# Altium schematic sheet Sheet1.SchDoc
size A4; Author: Caven; Revision: V2.0; SheetNumber: 1; SheetTotal: 2
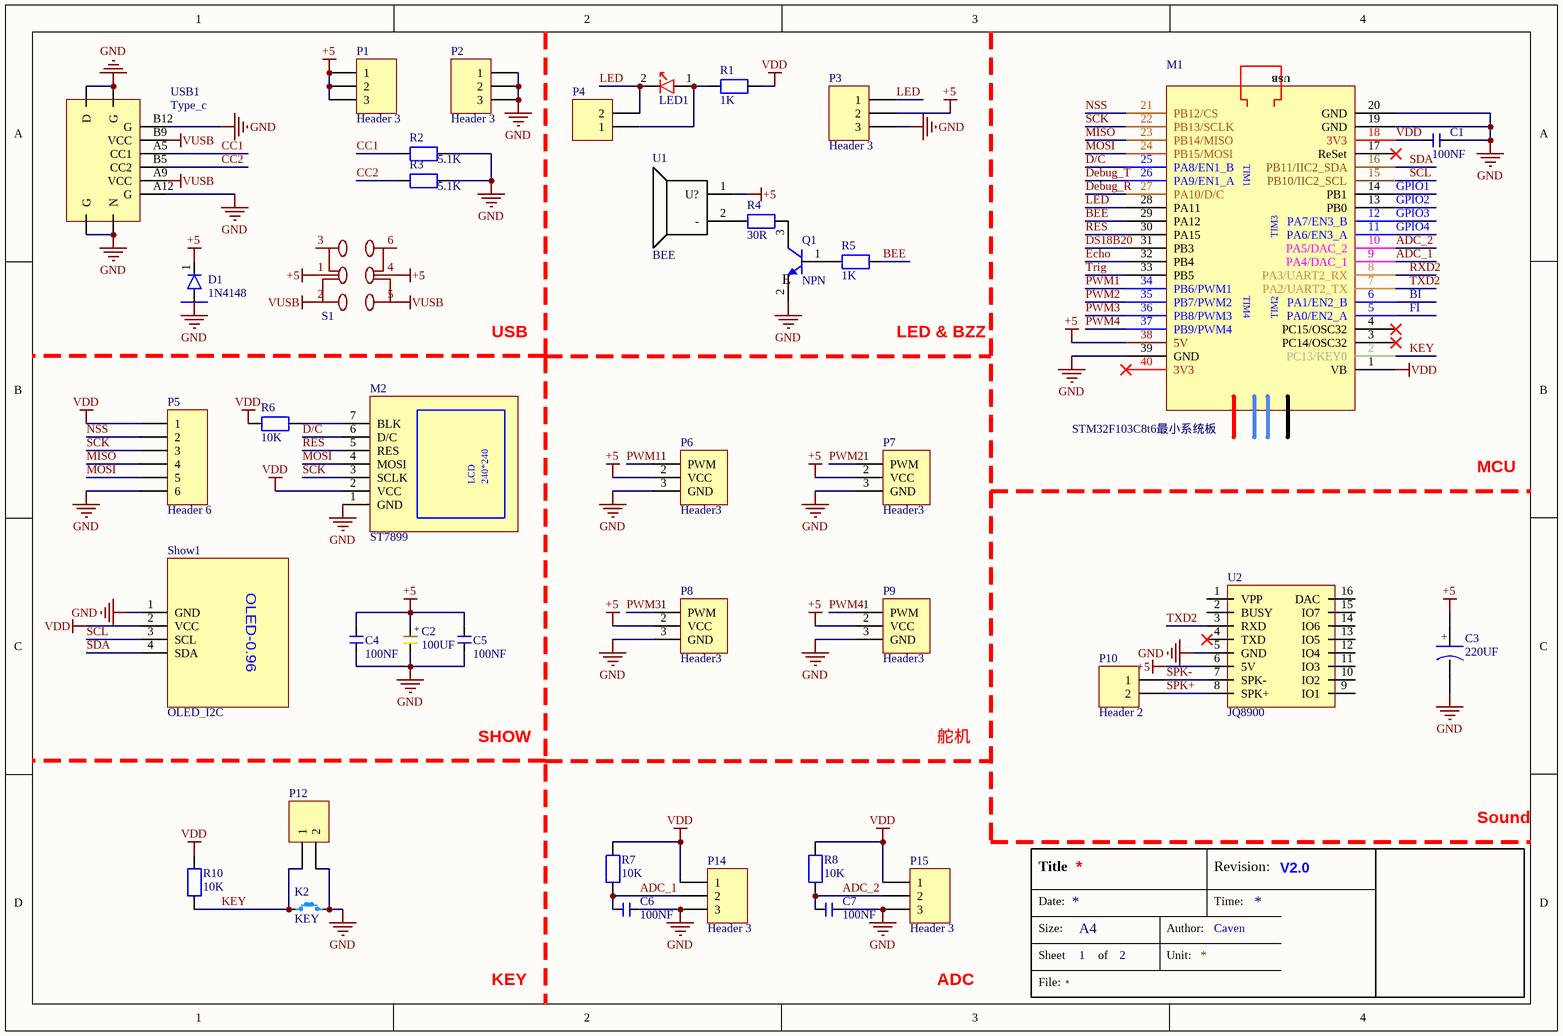
[diagram p0: Sheet1.SchDoc]

## Parts
C1  100NF  [CAP_0603]
C2  100UF  [CAP_3216_A]
C3  220UF  [CAP_PR_2.5_6.3_RA]
C4  100NF  [CAP_0603]
C5  100NF  [CAP_0603]
C6  100NF  [CAP_0603]
C7  100NF  [CAP_0603]
D1  1N4148  [Diode_DO35]
K2  KEY  [SW_PB_3X6]
LED1  LED_R/G/B/Y  [LED_5MM]  (value not drawn)
M1  STM32F103C8t6最小系统板  [STM32F103C8_Simple]
M2  ST7899  [LCD_1.3_MODE]
P1  Header 3  [Header 2.54X3]
P2  Header 3  [Header 2.54X3]
P3  Header 3  [XH_2.54_3P]
P4  Header 2  [XH_2.54_2P]  (value not drawn)
P5  Header 6  [HDR1X6]
P6  Header3  [Header 2.54X3]
P7  Header3  [Header 2.54X3]
P8  Header3  [Header 2.54X3]
P9  Header3  [Header 2.54X3]
P10  Header 2  [XH2.54-WI-2P]
P12  Header 2  [XH_2.54_2P]  (value not drawn)
P14  Header 3  [HDR1X3]
P15  Header 3  [HDR1X3]
Q1  NPN  [SOT23_3]
R1  1K  [RES_0.4_1/4W]
R2  5.1K  [RESC_0603_2]
R3  5.1K  [RESC_0603_2]
R4  30R  [RES_0.4_1/4W]
R5  1K  [RES_0.4_1/4W]
R6  10K  [RES_0.4_1/4W]
R7  10K  [RES_0.4_1/4W]
R8  10K  [RES_0.4_1/4W]
R10  10K  [RES_0.4_1/4W]
S1  Switch.02  [SWITCH-KFC-7]  (value not drawn)
Show1  OLED_I2C  [Header F 2.54X4]
U1  BEE  [BEE-FMQ5mm]
U2  JQ8900  [SpkMo]
USB1  Type_c  [USB-Type-c_6P]

## Nets
+5: C2.1 C3.1 C4.2 C5.2 D1.1(N) M1.38(5V) P1.1 P1.2 P1.3 P3.2 P6.2(VCC) P7.2(VCC) P8.2(VCC) P9.2(VCC) S1.1 S1.4 U1.1(U?) U2.6(5V)
GND: C1.1 C2.2 C3.2 C4.1 C5.1 C6.2 C7.2 D1.2(P) K2.1 M1.19(GND) M1.20(GND) M1.39(GND) M2.1(GND) P2.1 P2.2 P2.3 P3.3 P5.6 P6.3(GND) P7.3(GND) P8.3(GND) P9.3(GND) P12.2 P14.3 P15.3 Q1.2(E) R2.2 R3.2 Show1.1(GND) U2.5(GND) USB1.A(G) USB1.A12(G) USB1.B(N) USB1.B12(G) USB1.C(D) USB1.D(G)
VDD: C1.2 M1.1(VB) M1.18(3V3) M2.2(VCC) P5.1 P14.1 P15.1 R1.1 R6.2 R7.2 R8.2 R10.2 Show1.2(VCC)
VUSB: S1.2 S1.5 USB1.A9(VCC) USB1.B9(VCC)
ADC_1: C6.1 M1.9(PA4/DAC_1) P14.2 R7.1
ADC_2: C7.1 M1.10(PA5/DAC_2) P15.2 R8.1
BEE: M1.29(PA12) R5.1
BI: M1.6(PA1/EN2_B)
CC1: R2.1 USB1.A5(CC1)
CC2: R3.1 USB1.B5(CC2)
D/C: M1.25(PA8/EN1_B) M2.6(D/C)
Debug_R: M1.27(PA10/D/C)
Debug_T: M1.26(PA9/EN1_A)
DS18B20: M1.31(PB3)
Echo: M1.32(PB4)
FI: M1.5(PA0/EN2_A)
GPIO1: M1.14(PB1)
GPIO2: M1.13(PB0)
GPIO3: M1.12(PA7/EN3_B)
GPIO4: M1.11(PA6/EN3_A)
KEY: K2.2 M1.2(PC13/KEY0) P12.1 R10.1
LED: LED1.2(-) M1.28(PA11) P3.1 P4.2
MISO: M1.23(PB14/MISO) P5.4
MOSI: M1.24(PB15/MOSI) M2.4(MOSI) P5.5
NSS: M1.21(PB12/CS) P5.2
PWM1: M1.34(PB6/PWM1) P6.1(PWM)
PWM2: M1.35(PB7/PWM2) P7.1(PWM)
PWM3: M1.36(PB8/PWM3) P8.1(PWM)
PWM4: M1.37(PB9/PWM4) P9.1(PWM)
RES: M1.30(PA15) M2.5(RES)
RXD2: M1.8(PA3/UART2_RX)
SCK: M1.22(PB13/SCLK) M2.3(SCLK) P5.3
SCL: M1.15(PB10/IIC2_SCL) Show1.3(SCL)
SDA: M1.16(PB11/IIC2_SDA) Show1.4(SDA)
SPK+: P10.2 U2.8(SPK+)
SPK-: P10.1 U2.7(SPK-)
Trig: M1.33(PB5)
TXD2: M1.7(PA2/UART2_TX) U2.3(RXD)
NetLED1_1: LED1.1(+) P4.1 R1.2
NetM2_7: M2.7(BLK) R6.1
NetQ1_1: Q1.1(B) R5.2
NetQ1_3: Q1.3(C) R4.1
NetR4_2: R4.2 U1.2(-)

Not connected (* = marked no-connect by the designer): M1 3(PC14/OSC32)* 4(PC15/OSC32)* 17(ReSet)* 40(3V3)*; S1 3 6; U2 1(VPP) 2(BUSY) 4(TXD)* 9(IO1) 10(IO2) 11(IO3) 12(IO4) 13(IO5) 14(IO6) 15(IO7) 16(DAC)

## Notes on the sheet
- USB
- LED & BZZ
- MCU
- SHOW
- 舵机
- Sound
- KEY
- ADC
- Title
- Date:
- Revision:
- Time:
- File:
- Size:
- Sheet
- A4
- of
- Author:
- Unit:
- (in symbol CAP_BIG) +
- (in symbol CAP_TA) +
- (in symbol LCD_TFT_1.3_MODE) LCD; 240*240
- (in symbol OLED_I2C) OLED-0.96
- (in symbol STM32F103C-Sys) USB; TIM1; TIM3; TIM4; TIM2

## Library data of the parts
C1 C4-C7 = CAP: CAP  12~50V
C2 = CAP_TA: CAP  6~12V  钽电容
C3 = CAP_BIG: CAP 12V ~ 50V   电解电容
D1 = Diode-DO: Diode_肖特基/二极管 / 直插
LED1 = LED
M1 = STM32F103C-Sys: Mode STM32F103C8t6最小系统板
M2 = LCD_TFT_1.3_MODE: SHOW
P1-P3 P14 P15 = Header 3: Header, 3-Pin; LatestRevisionDate: 17-Jul-2002; LatestRevisionNote: Re-released for DXP Platform.; Publisher: Altium Limited
P4 P10 P12 = Header 2: Header, 2-Pin; LatestRevisionDate: 17-Jul-2002; LatestRevisionNote: Re-released for DXP Platform.; Publisher: Altium Limited
P5 = Header 6: Header, 6-Pin; LatestRevisionDate: 17-Jul-2002; LatestRevisionNote: Re-released for DXP Platform.; Publisher: Altium Limited
P6-P9 = PWM_D: Header
R1-R8 R10 = RES: RES 贴片
S1 = Switch_2: Switch
Show1 = OLED_I2C: MODE
U1 = BZZ
U2 = SPKMO_8900: MODE
USB1 = USB-Type_c-6PIn: USB